# Altium schematic sheet Port2&3.SchDoc: AMC FMC Carrier v4
size A4; CompanyName: WUT; Organization: WUT ISE; Address1: Warsaw Univeristy of Technology; Address2: Nowowiejska 15/19 00-665 Warsaw; Address3: t.przywozki@gmail.com; Revision: 1; SheetNumber: 25; SheetTotal: 29; Project: AMC FMC Carrier v4; ModifiedBy: -; CreateDate: XX/XX/XXXX; CheckedDate: -; Title2: PORT 2 & 3; DivGrp: ISE; Designer: T. Przywozki; ModifiedDate: -; ProjectName: ADC/DAC MEZZANINE
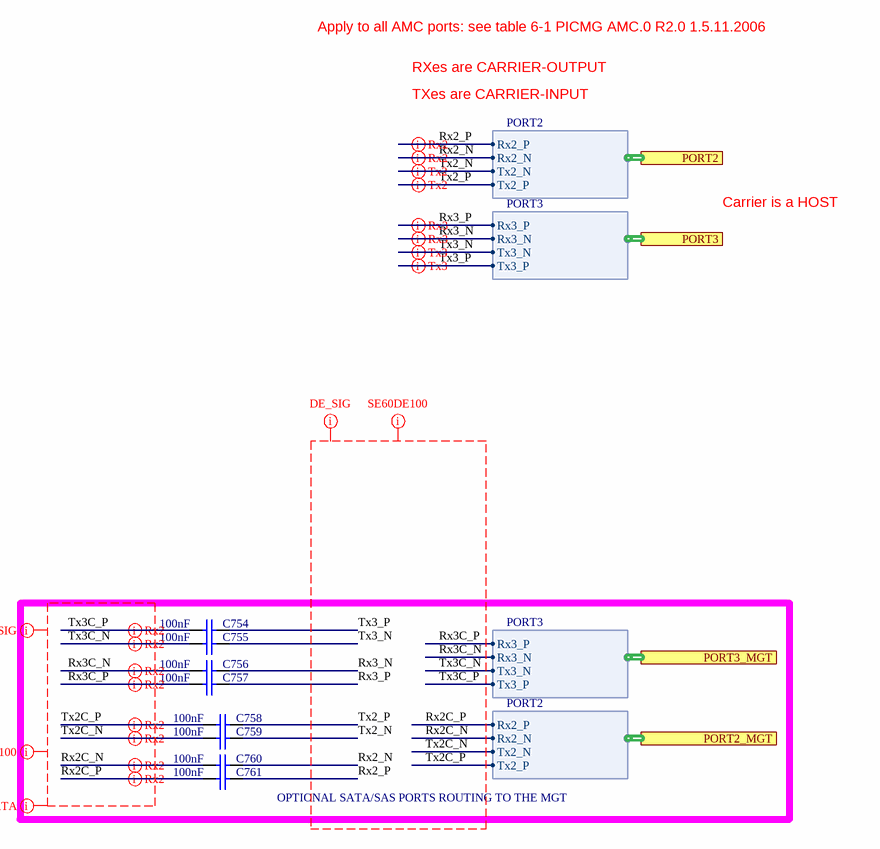
[diagram p0: Port2&3.SchDoc]

## Parts
C754  100nF  [CAPC0603X33N]
C755  100nF  [CAPC0603X33N]
C756  100nF  [CAPC0603X33N]
C757  100nF  [CAPC0603X33N]
C758  100nF  [CAPC0603X33N]
C759  100nF  [CAPC0603X33N]
C760  100nF  [CAPC0603X33N]
C761  100nF  [CAPC0603X33N]

## Blocks framed on the sheet
OPTIONAL SATA/SAS PORTS ROUTING TO THE MGT: C754-C761

## Ports
PORT2 (harness PORT2), PORT2_MGT (harness PORT2), PORT3 (harness PORT3), PORT3_MGT (harness PORT3)

## Harnesses
PORT2: Rx2_P, Rx2_N, Tx2_N, Tx2_P
PORT3: Rx3_P, Rx3_N, Tx3_N, Tx3_P

## Nets
Rx2_N: C760.2 ; port PORT2.Rx2_N
Rx2_P: C761.2 ; port PORT2.Rx2_P
Rx2C_N: C760.1 ; port PORT2_MGT.Rx2_N
Rx2C_P: C761.1 ; port PORT2_MGT.Rx2_P
Rx3_N: C756.2 ; port PORT3.Rx3_N
Rx3_P: C757.2 ; port PORT3.Rx3_P
Rx3C_N: C756.1 ; port PORT3_MGT.Rx3_N
Rx3C_P: C757.1 ; port PORT3_MGT.Rx3_P
Tx2_N: C759.2 ; port PORT2.Tx2_N
Tx2_P: C758.2 ; port PORT2.Tx2_P
Tx2C_N: C759.1 ; port PORT2_MGT.Tx2_N
Tx2C_P: C758.1 ; port PORT2_MGT.Tx2_P
Tx3_N: C755.2 ; port PORT3.Tx3_N
Tx3_P: C754.2 ; port PORT3.Tx3_P
Tx3C_N: C755.1 ; port PORT3_MGT.Tx3_N
Tx3C_P: C754.1 ; port PORT3_MGT.Tx3_P

## Layout directives
differential pair: Rx2_N, Rx2_P, Rx2C_N, Rx2C_P, Rx3_N, Rx3_P, Rx3C_N, Rx3C_P, Tx2_N, Tx2_P, Tx2C_N, Tx2C_P, Tx3_N, Tx3_P, Tx3C_N, Tx3C_P
net class SATA: Rx2C_N, Rx2C_P, Rx3C_N, Rx3C_P, Tx2C_N, Tx2C_P, Tx3C_N, Tx3C_P
net class SE60DE100: Rx2_N, Rx2_P, Rx2C_N, Rx2C_P, Rx3_N, Rx3_P, Rx3C_N, Rx3C_P, Tx2_N, Tx2_P, Tx2C_N, Tx2C_P, Tx3_N, Tx3_P, Tx3C_N, Tx3C_P
net class DE_SIG: Rx2_N, Rx2_P, Rx2C_N, Rx2C_P, Rx3_N, Rx3_P, Rx3C_N, Rx3C_P, Tx2_N, Tx2_P, Tx2C_N, Tx2C_P, Tx3_N, Tx3_P, Tx3C_N, Tx3C_P

## Notes on the sheet
- Apply to all AMC ports: see table 6-1 PICMG AMC.0 R2.0 1.5.11.2006
- RXes are CARRIER-OUTPUT
- TXes are CARRIER-INPUT
- Carrier is a HOST
- Project/Equipment
- Document
- Designer
- Drawn by
- Check.by
- Copyright CNPEM 2013, WUT ISE 2020
  This documentation describes Open Hardware and is licensed under CERN OHL v.1.1. You may redistribute and modify this documentaction under the terms of the CERN OHL v1.1.
  (http://ohwr.org/CERNOHL). This documentation is dristributed WITHOUT ANY EXPRESS OR IMPLIED WARRANTY, INCLUDING OF MERCHANTABLITY, SATISFACTORY QUALITY AND FITNESS FOR A PARTICULAR PURPOSE. Please see the CERN OHL v.1.1 for applicable conditions
- File
- Last Mod.
- Print Date
- Sheet
- Size
- A4
- of
- Rev
- Contact:

## Library data of the parts
C754-C761 = CC0201_100NF_6.3V_10%_X5R: Non-polarised capacitor; Part Description: SMD Multilayer Chip Ceramic Capacitor; Manufacturer: GENERIC; Manufacturer1 Part Number: 02016D104KAT2A; Voltage: 6.3V; TC: X5R; Tolerance: ±10%; Table: Capacitors SMD; Part Number: CC0201_100NF_6.3V_10%_X5R; Component Kind: Standard; Component Type: Standard; Pin Count: 2; Value: 100nF; Status: Not Recommended; Manufacturer Part Number: CC0201_100NF_6.3V_10%_X5R; Case: 0201; Mounted: Yes; Socket: No; SMD: Yes; Manufacturer1 Example: AVX; Manufacturer1 ComponentHeight: 0.33mm; HelpURL: \\cern.ch\dfs\Applications\Altium\Datasheets\CC0201_X5R_AVX.pdf; Author: CERN DEM JLC; CreateDate: 2007-12-03; LatestRevisionDate: 2007-12-03